# Altium project Laser_game_4.0.PrjPcb
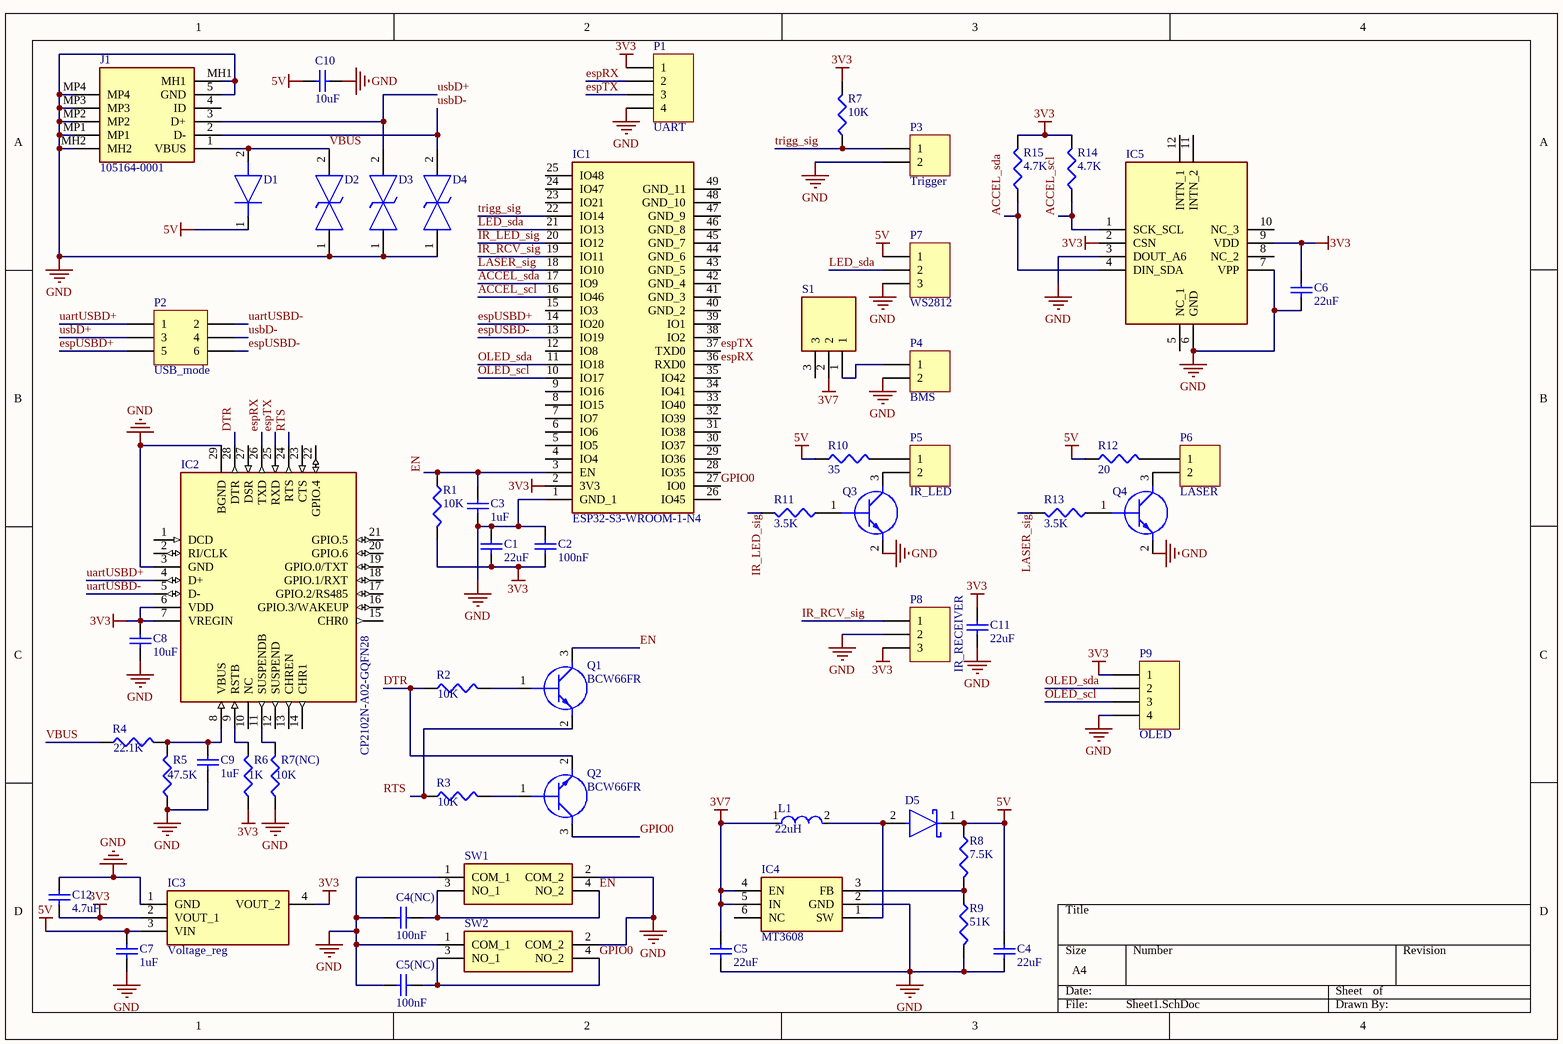
[diagram p0: Sheet1.SchDoc]
1 sheet, 58 parts. Net scope: global (net labels, ports and power ports of the same name join across sheets).
Board file: PCB1.PcbDoc

## Sheet Sheet1.SchDoc
size A4; SheetNumber: 1; SheetTotal: 1

### Parts
C1  value 22uF  [1608[0603]]  (hidden comment: Cap Semi)
C2  value 100nF  [1608[0603]]  (hidden comment: Cap Semi)
C3  value 1uF  [1608[0603]]  (hidden comment: Cap Semi)
C4  value 22uF  [1608[0603]]  (hidden comment: Cap Semi)
C4(NC)  value 100nF  [1608[0603]]  (hidden comment: Cap Semi)
C5  value 22uF  [1608[0603]]  (hidden comment: Cap Semi)
C5(NC)  value 100nF  [1608[0603]]  (hidden comment: Cap Semi)
C6  value 22uF  [1608[0603]]  (hidden comment: Cap Semi)
C7  value 1uF  [1608[0603]]  (hidden comment: Cap Semi)
C8  value 10uF  [1608[0603]]  (hidden comment: Cap Semi)
C9  value 1uF  [1608[0603]]  (hidden comment: Cap Semi)
C10  value 10uF  [1608[0603]]  (hidden comment: Cap Semi)
C11  value 22uF  [1608[0603]]  (hidden comment: Cap Semi)
C12  value 4.7uF  [1608[0603]]  (hidden comment: Cap Semi)
D1  1N5819HW-7-F  [SOD3716X145N]  (value not drawn)
D2  DF2B6M4CT,L3F  [DF2B6M4CTL3F]  (value not drawn)
D3  DF2B6M4CT,L3F  [DF2B6M4CTL3F]  (value not drawn)
D4  DF2B6M4CT,L3F  [DF2B6M4CTL3F]  (value not drawn)
D5  B340-13-F  [FP-SMC-MFG]  (value not drawn)
IC1  ESP32-S3-WROOM-1-N4  [ESP32S3WROOM1N4]
IC2  CP2102N-A02-GQFN28  [QFN50P500X500X80-29N-D]
IC3  Voltage_reg  [SOT230P700X180-4N]
IC4  MT3608  [SOT95P280X145-6N]
IC5  MC3479  [MC3479]  (value not drawn)
J1  105164-0001  [1051640001]
L1  value 22uH  [FP-SRN8040-MFG]  (hidden comment: SRN8040-220M)
P1  UART  [HDR1X4]
P2  USB_mode  [HDR2X3]
P3  Trigger  [HDR1X2]
P4  BMS  [HDR1X2]
P5  IR_LED  [HDR1X2]
P6  LASER  [HDR1X2]
P7  WS2812  [HDR1X3]
P8  IR_RECEIVER  [HDR1X3]
P9  OLED  [HDR1X4]
Q1  BCW66FR  [SOT95P230X110-3N]
Q2  BCW66FR  [SOT95P230X110-3N]
Q3  BCW66FR  [SOT95P230X110-3N]  (value not drawn)
Q4  BCW66FR  [SOT95P230X110-3N]  (value not drawn)
R1  value 10K  [J1-0603]  (hidden comment: Res3)
R2  value 10K  [J1-0603]  (hidden comment: Res3)
R3  value 10K  [J1-0603]  (hidden comment: Res3)
R4  value 22.1K  [J1-0603]  (hidden comment: Res3)
R5  value 47.5K  [J1-0603]  (hidden comment: Res3)
R6  value 1K  [J1-0603]  (hidden comment: Res3)
R7  value 10K  [J1-0603]  (hidden comment: Res3)
R7(NC)  value 10K  [J1-0603]  (hidden comment: Res3)
R8  value 7.5K  [J1-0603]  (hidden comment: Res3)
R9  value 51K  [J1-0603]  (hidden comment: Res3)
R10  value 35  [J1-0603]  (hidden comment: Res3)
R11  value 3.5K  [J1-0603]  (hidden comment: Res3)
R12  value 20  [J1-0603]  (hidden comment: Res3)
R13  value 3.5K  [J1-0603]  (hidden comment: Res3)
R14  value 4.7K  [J1-0603]  (hidden comment: Res3)
R15  value 4.7K  [J1-0603]  (hidden comment: Res3)
S1  1101M2S3CQE2  [1000-SERIES(SPDT)]  (value not drawn)
SW1  PTS526_SM15_SMTR2_LFS  [PTS526SM15SMTR2LFS]  (value not drawn)
SW2  PTS526_SM15_SMTR2_LFS  [PTS526SM15SMTR2LFS]  (value not drawn)

### Nets
3V3: C1.2 C2.2 C6.1 C8.2 C11.1 C12.2 IC1.2(3V3) IC2.6(VDD) IC2.7(VREGIN) IC3.2(VOUT_1) IC3.4(VOUT_2) IC5.2(CSN) IC5.9(VDD) P1.1 P8.3 P9.1 R1.1 R6.1 R7.2 R14.2 R15.2
3V7: C5.1 IC4.4(EN) IC4.5(IN) L1.1 S1.2
5V: C4.1 C7.1 C10.2 D1.1(K) D5.1(C) IC3.3(VIN) P7.1 R8.2 R10.1 R12.1
GND: C1.1 C2.1 C3.2 C4.2 C4(NC).2 C5.2 C5(NC).2 C6.2 C7.2 C8.1 C9.1 C10.1 C11.2 C12.1 D2.1 D3.1 D4.1 IC1.1(GND_1) IC2.3(GND) IC2.29(BGND) IC3.1(GND) IC4.2(GND) IC5.3(DOUT_A6) IC5.6(GND) IC5.7(VPP) J1.5(GND) J1.MH1 J1.MH2 J1.MP1 J1.MP2 J1.MP3 J1.MP4 P1.4 P3.2 P4.2 P7.3 P8.2 P9.4 Q3.2(E) Q4.2(E) R5.1 R7(NC).1 R9.1 SW1.1(COM_1) SW1.2(COM_2) SW2.1(COM_1) SW2.2(COM_2)
ACCEL_scl: IC1.16(IO46) IC5.1(SCK_SCL) R14.1
ACCEL_sda: IC1.17(IO9) IC5.4(DIN_SDA) R15.1
DTR: IC2.28(DTR) Q2.2(E) R2.1
EN: C3.1 C4(NC).1 IC1.3(EN) Q1.3(C) R1.2 SW1.3(NO_1) SW1.4(NO_2)
espRX: IC1.36(RXD0) IC2.26(TXD) P1.2
espTX: IC1.37(TXD0) IC2.25(RXD) P1.3
espUSBD+: IC1.14(IO20) P2.5
espUSBD-: IC1.13(IO19) P2.6
GPIO0: C5(NC).1 IC1.27(IO0) Q2.3(C) SW2.3(NO_1) SW2.4(NO_2)
IR_LED_sig: IC1.20(IO12) R11.2
IR_RCV_sig: IC1.19(IO11) P8.1
LASER_sig: IC1.18(IO10) R13.2
LED_sda: IC1.21(IO13) P7.2
OLED_scl: IC1.10(IO17) P9.3
OLED_sda: IC1.11(IO18) P9.2
RTS: IC2.24(RTS)
trigg_sig: IC1.22(IO14) P3.1 R7.1
uartUSBD+: IC2.4(D+) P2.1
uartUSBD-: IC2.5(D-) P2.2
usbD+: D3.2 J1.3(D+) P2.3
usbD-: D4.2 J1.2(D-) P2.4
VBUS: D1.2(A) D2.2 J1.1(VBUS) R4.1
NetC9_2: C9.2 IC2.8(VBUS) R4.2 R5.2
NetD5_2: D5.2(A) IC4.1(SW) L1.2
NetIC2_9: IC2.9(RSTB) R6.2
NetIC2_11: IC2.11(SUSPENDB) R7(NC).2
NetIC4_3: IC4.3(FB) R8.1 R9.2
NetP4_1: P4.1 S1.1
NetP5_1: P5.1 R10.2
NetP5_2: P5.2 Q3.3(C)
NetP6_1: P6.1 R12.2
NetP6_2: P6.2 Q4.3(C)
NetQ1_1: Q1.1(B) R2.2
NetQ1_2: Q1.2(E) R3.1
NetQ2_1: Q2.1(B) R3.2
NetQ3_1: Q3.1(B) R11.1
NetQ4_1: Q4.1(B) R13.1

Not connected (* = marked no-connect by the designer): IC1 4(IO4) 5(IO5) 6(IO6) 7(IO7) 8(IO15) 9(IO16) 12(IO8) 15(IO3) 23(IO21) 24(IO47) 25(IO48) 26(IO45) 28(IO35) 29(IO36) 30(IO37) 31(IO38) 32(IO39) 33(IO40) 34(IO41) 35(IO42) 38(IO2) 39(IO1) 40(GND_2) 41(GND_3) 42(GND_4) 43(GND_5) 44(GND_6) 45(GND_7) 46(GND_8) 47(GND_9) 48(GND_10) 49(GND_11); IC2 1(DCD) 2(RI/CLK) 10(NC) 12(SUSPEND) 13(CHREN) 14(CHR1) 15(CHR0) 16(GPIO.3/WAKEUP) 17(GPIO.2/RS485) 18(GPIO.1/RXT) 19(GPIO.0/TXT) 20(GPIO.6) 21(GPIO.5) 22(GPIO.4) 23(CTS) 27(DSR); IC4 6(NC); IC5 5(NC_1) 8(NC_2) 10(NC_3) 11(INTN_2) 12(INTN_1); J1 4(ID); S1 3

### Notes on the sheet
- Labels drawn without touching a wire or pin: RTS

### Library data of the parts
C1-C4 C4(NC) C5 C5(NC) C6-C12 = Cap Semi: Capacitor (Semiconductor SIM Model); Published: 8-Jun-2000; LatestRevisionDate: 29-May-2009; LatestRevisionNote: IPC-7351 Footprint Added.; PackageReference: C1206; Publisher: Altium Limited; PackageDescription: Chip Capacitor
D1 = 1N5819HW-7-F: Diode; Manufacturer_Name: Diodes Inc.; Datasheet Link: https://datasheet.datasheetarchive.com/originals/distributors/Datasheets-DGA23/1390892.pdf; Height: 1.45mm; Manufacturer_Part_Number: 1N5819HW-7-F; Mouser Part Number: 621-1N5819HW-F; Mouser Price/Stock: https://www.mouser.co.uk/ProductDetail/Diodes-Incorporated/1N5819HW-7-F?qs=NQ47qNm99eDyWTEd07miYA%3D%3D; Arrow Part Number: 1N5819HW-7-F; Arrow Price/Stock: https://www.arrow.com/en/products/1n5819hw-7-f/diodes-incorporated?region=europe
D2-D4 = DF2B6M4CT,L3F: TVS Diode (Bi-directional); Manufacturer_Name: Toshiba; Datasheet Link: https://static6.arrow.com/aropdfconversion/35aad045143cfbe56d4c3115b403a38cdd93b55b/3docget.jspdid55771prodnamedf2b6m4ct.jspdid55771prodnamedf2b6m4ct..pdf; Height: 0.4mm; Manufacturer_Part_Number: DF2B6M4CT,L3F; Mouser Part Number: 757-DF2B6M4CTL3F; Mouser Price/Stock: https://www.mouser.co.uk/ProductDetail/Toshiba/DF2B6M4CTL3F/?qs=HXFqYaX1Q2xAOjv9GW6UtQ%3D%3D; Arrow Part Number: DF2B6M4CT,L3F; Arrow Price/Stock: https://www.arrow.com/en/products/df2b6m4ctl3f/toshiba
D5 = CMP-12790-000049-1: DIODE SCHOTTKY 40V 3A SMC; Manufacturer: Diodes Inc.; Max Surge Forward Current: 100A; Peak Reverse Current: 0.1mA; Max Junction Temp: +150°C; Value: 200pF; Standoff Height: 0.1mm; Temperature: -55°C to +150°C; Reverse Voltage: 40V; Max Repetitive Reverse Voltage: 40V; Forward Current: 3A; Device Class L2: Diodes; RoHS: TRUE; Footprint Url: https://www.diodes.com/assets/Package-Files/SMC.pdf; Digikey Description: DIODE SCHOTTKY 40V 3A SMC; Package: SMC; Category: Diode; ComponentLink2Description: Datasheet; Temperature Range High: +150°C; Lead Free: Yes; Mouser Description: Diode Schottky 40V 3A 2-Pin SMC T/R Diode Schottky 40V 3A 2-Pin SMC T/R; Manufacturer Part Number: B340-13-F; Octopart: https://octopart.com/b340-13-f-diodes+inc.-325814; Automotive: No; ComponentLink2URL: https://www.diodes.com/assets/Datasheets/ds30923.pdf; Capacitance: 200pF; Device Class L1: Discrete Semiconductors; Temperature Range Low: -55°C; Height: 2.5mm; Device Class L3: Schottky Diodes
IC1 = ESP32-S3-WROOM-1-N4: Integrated Circuit; Manufacturer_Name: Espressif Systems; Datasheet Link: https://www.espressif.com/sites/default/files/documentation/esp32-s3-wroom-1_wroom-1u_datasheet_en.pdf; Height: 3.25mm; Manufacturer_Part_Number: ESP32-S3-WROOM-1-N4; Mouser Part Number: 356-ESP32-S3WROOM1N4; Mouser Price/Stock: https://www.mouser.co.uk/ProductDetail/Espressif-Systems/ESP32-S3-WROOM-1-N4?qs=Li%252BoUPsLEnsO%2FkiJOUK0FQ%3D%3D
IC2 = CP2102N-A02-GQFN28: Integrated Circuit; Manufacturer_Name: Silicon Labs; Datasheet Link: https://componentsearchengine.com/Datasheets/2/CP2102N-A02-GQFN28.pdf; Height: 0.8mm; Manufacturer_Part_Number: CP2102N-A02-GQFN28; Mouser Part Number: 634-CP2102NA02GQFN28; Mouser Price/Stock: https://www.mouser.co.uk/ProductDetail/Silicon-Labs/CP2102N-A02-GQFN28?qs=u16ybLDytRaSBkSkyjYFiA%3D%3D; Arrow Part Number: CP2102N-A02-GQFN28; Arrow Price/Stock: https://www.arrow.com/en/products/cp2102n-a02-gqfn28/silicon-labs?region=europe
IC3 = LDL1117S33R: Integrated Circuit; Manufacturer_Name: STMicroelectronics; Datasheet Link: https://componentsearchengine.com/Datasheets/2/LDL1117S33R.pdf; Height: 1.8mm; Manufacturer_Part_Number: LDL1117S33R; Mouser Part Number: 511-LDL1117S33R; Mouser Price/Stock: https://www.mouser.co.uk/ProductDetail/STMicroelectronics/LDL1117S33R?qs=AQlKX63v8Rt9Bf6AWSrbFg%3D%3D; Arrow Part Number: LDL1117S33R; Arrow Price/Stock: https://www.arrow.com/en/products/ldl1117s33r/stmicroelectronics?region=nac
IC4 = MT3608: Integrated Circuit; Manufacturer_Name: Aerosemi; Datasheet Link: https://www.olimex.com/Products/Breadboarding/BB-PWR-3608/resources/MT3608.pdf; Height: 1.45mm; Manufacturer_Part_Number: MT3608
IC5 = MC3479: Integrated Circuit; Manufacturer_Name: MEMSIC; Datasheet Link: http://www.memsic.com/uploadfiles/2020/08/20200827164636363.pdf; Height: 1mm; Manufacturer_Part_Number: MC3479; Mouser Part Number: 498-MC3479; Mouser Price/Stock: https://www.mouser.co.uk/ProductDetail/MEMSIC/MC3479?qs=OlC7AqGiEDmYmlaMvA9fTA%3D%3D; Arrow Part Number: MC3479; Arrow Price/Stock: https://www.arrow.com/en/products/mc3479/memsic?region=nac
J1 = 105164-0001: Connector; Manufacturer_Name: Molex; Datasheet Link: https://www.molex.com/pdm_docs/sd/1051640001_sd.pdf; Height: 2.7mm; Manufacturer_Part_Number: 105164-0001; Mouser Part Number: 538-105164-0001; Mouser Price/Stock: https://www.mouser.co.uk/ProductDetail/Molex/105164-0001?qs=JAwGc6FMfvtRY4SkW%2FoGcQ%3D%3D
L1 = CMP-07248-000047-1: FIXED IND 22UH 2.2A 100 MOHM SMD; Material: Steel; Self Resonant Frequency: 12MHz; Shielding: Shielded; Sample Rate (Hz): 100kHz; DC Resistance (DCR): 100mR; Tolerance: 20%; Core Material: Ferrite; Packaging: Tape and Reel; Case/Package: Nonstandard; Termination: SMD/SMT; Mount: Surface Mount; RoHS Compliant: Yes; Military Standard: Not; Package Quantity: 1000; Depth: 8.3mm; Max Operating Temperature: 125°C; DC Current: 2.2A; Inductance: 22uH; Width: 8mm; Max DC Current: 2.2A; Min Operating Temperature: -40°C; Height: 4mm; Height - Seated (Max): 0.157inch; Test Frequency: 100kHz; REACH SVHC: No SVHC; RMS Current (Irms): 2.2A; Length: 8mm; Series: SRN8040; Number of Pins: 2; Resistor Type: Wirewound; Saturation Current: 2.2A; Inductance Tolerance: 20%; Current Rating: 2.2A
P1 P9 = Header 4: Header, 4-Pin; LatestRevisionDate: 17-Jul-2002; LatestRevisionNote: Re-released for DXP Platform.; Publisher: Altium Limited
P2 = Header 3X2: Header, 3-Pin, Dual row; LatestRevisionDate: 17-Jul-2002; LatestRevisionNote: Re-released for DXP Platform.; Publisher: Altium Limited
P3-P6 = Header 2: Header, 2-Pin; LatestRevisionDate: 17-Jul-2002; LatestRevisionNote: Re-released for DXP Platform.; Publisher: Altium Limited
P7 P8 = Header 3: Header, 3-Pin; LatestRevisionDate: 17-Jul-2002; LatestRevisionNote: Re-released for DXP Platform.; Publisher: Altium Limited
Q1-Q4 = BCW66FR: Transistor BJT NPN; Manufacturer_Name: Nexperia; Datasheet Link: https://www.mouser.in/datasheet/2/916/BCW66X_SER-1319560.pdf; Height: 1.1mm; Manufacturer_Part_Number: BCW66FR; Mouser Part Number: 771-BCW66FR; Mouser Price/Stock: https://www.mouser.co.uk/ProductDetail/Nexperia/BCW66FR?qs=vLWxofP3U2xgYVmJT%2Fr4qw%3D%3D; Arrow Part Number: BCW66FR; Arrow Price/Stock: https://www.arrow.com/en/products/bcw66fr/nexperia?region=europe
R1-R7 R7(NC) R8-R15 = Res3: Resistor; Published: 8-Jun-2000; LatestRevisionDate: 29-May-2009; LatestRevisionNote: IPC-7351 Footprint Added.; PackageReference: J1-0603; Publisher: Altium Limited; PackageDescription: Chip Resistor
S1 = 1101M2S3CQE2: Switch; Manufacturer_Name: C & K COMPONENTS; Datasheet Link: https://www.ckswitches.com/media/1429/1000.pdf; Manufacturer_Part_Number: 1101M2S3CQE2; Mouser Part Number: 611-1101M2S3CQE2; Mouser Price/Stock: https://www.mouser.co.uk/ProductDetail/CK/1101M2S3CQE2?qs=C4UUOezh8MStnZqkTHGAfQ%3D%3D; Arrow Part Number: 1101M2S3CQE2; Arrow Price/Stock: https://www.arrow.com/en/products/1101m2s3cqe2/ck?region=europe
SW1 SW2 = PTS526_SM15_SMTR2_LFS: Switch; Manufacturer_Name: C & K COMPONENTS; Manufacturer_Part_Number: PTS526 SM15 SMTR2 LFS; Datasheet Link: https://www.mouser.com/datasheet/2/60/pts526-1651200.pdf; Height: 1.5mm; Mouser Part Number: 611-PTS526SM15SMTR2L; Mouser Price/Stock: https://www.mouser.co.uk/ProductDetail/CK/PTS526-SM15-SMTR2-LFS?qs=UXgszm6BlbENivbslIA%252B5g%3D%3D; Arrow Part Number: PTS526 SM15 SMTR2 LFS; Arrow Price/Stock: https://www.arrow.com/en/products/pts526-sm15-smtr2-lfs/ck?region=nac